# EAGLE design 05_ServoStage_v1 (EAGLE 9.6.2)

## Sheet 1 of 2
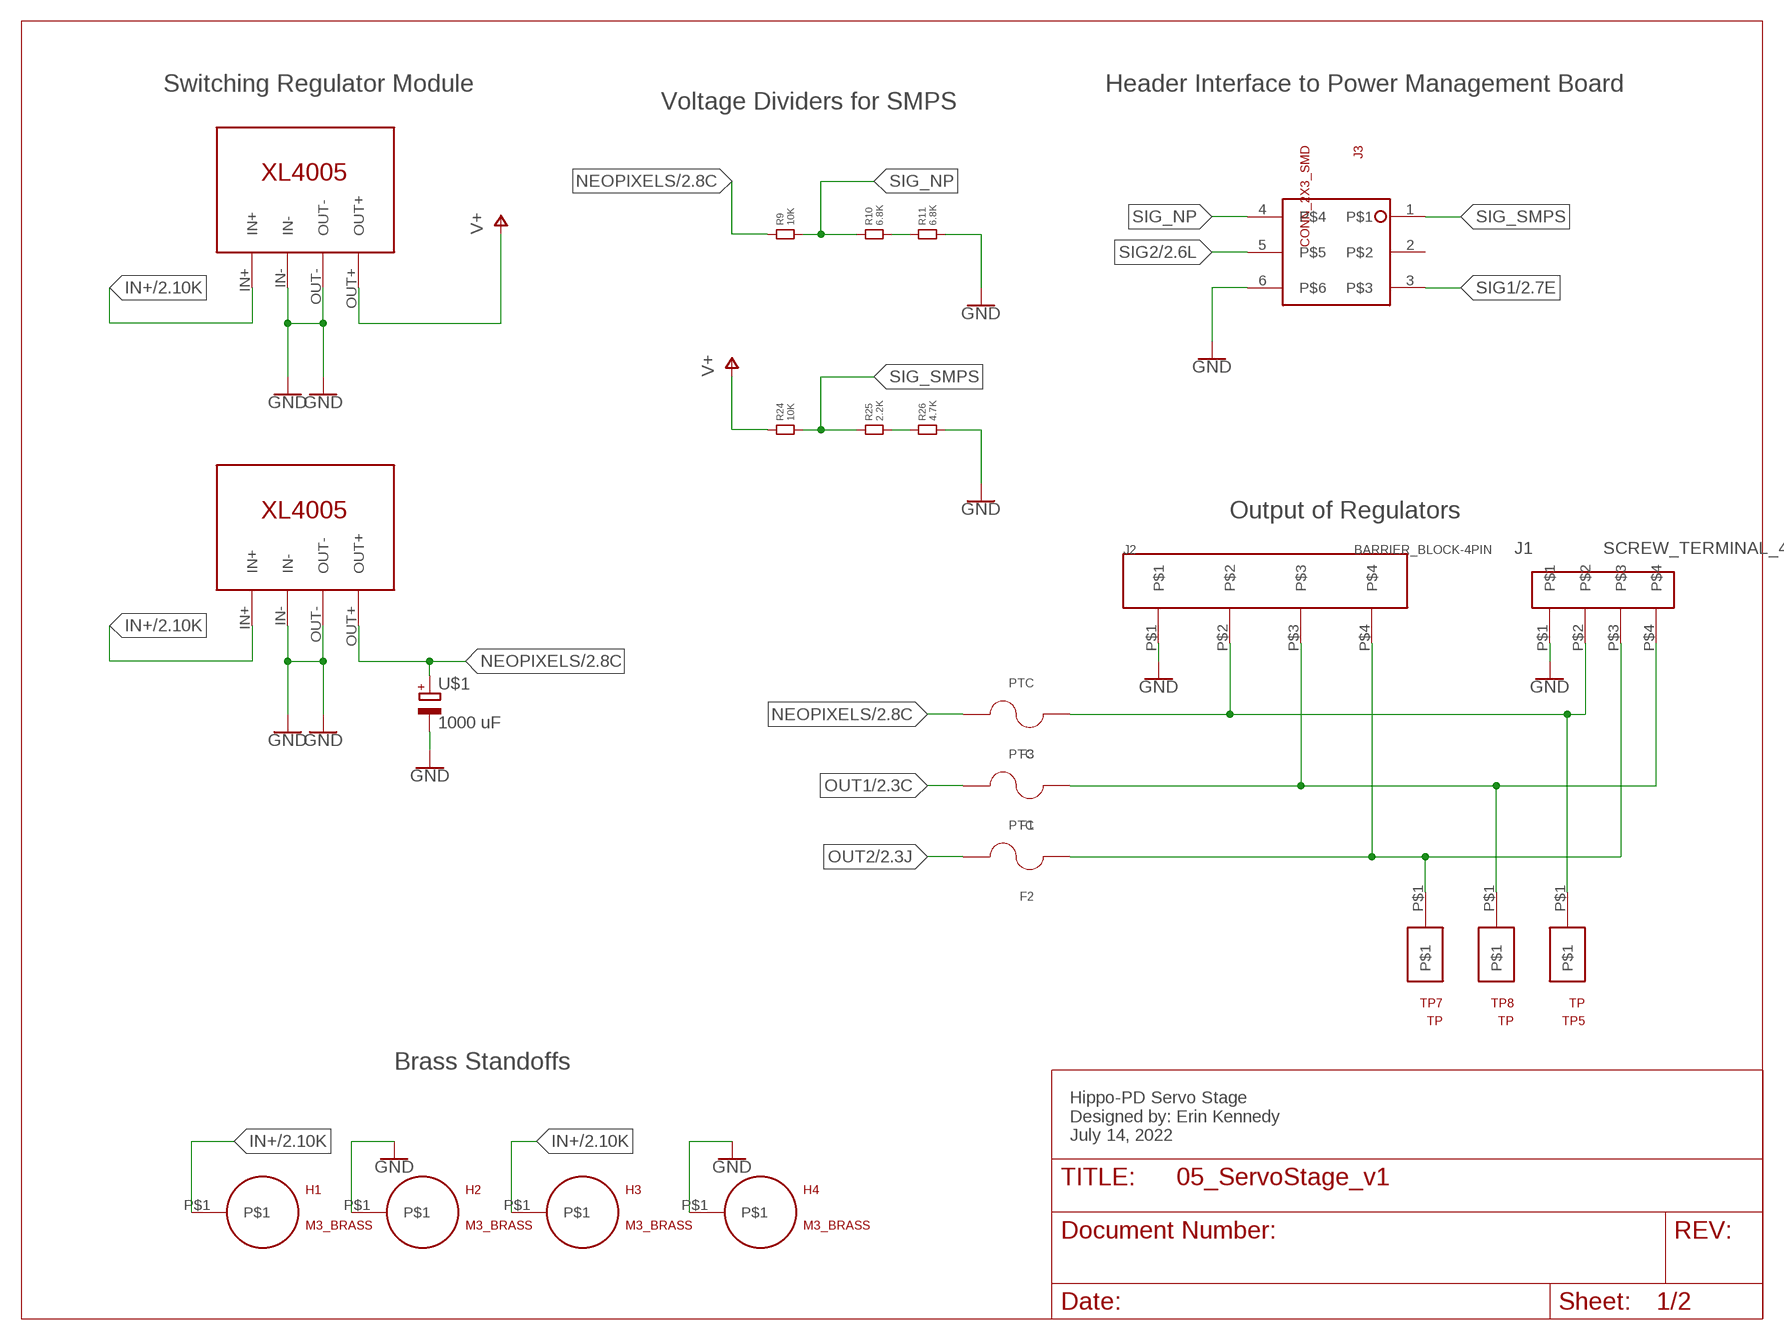
[diagram p0: schematic, sheet 1]

### Parts
F1  PTC  [PTC]
F2  PTC  [PTC]
F3  PTC  [PTC]
H1  M3_BRASS  [M3_BRASS]
H2  M3_BRASS  [M3_BRASS]
H3  M3_BRASS  [M3_BRASS]
H4  M3_BRASS  [M3_BRASS]
J1  SCREW_TERMINAL_4  [SCREW_TERM_4]
J2  BARRIER_BLOCK-4PIN  [BARRIERBLOCK-4PIN]
J3  CONN_2X3_SMD  [2X3_SMD_CONNECTOR]
R9  10K  RESISTOR.1206  [1206]
R10  6.8K  RESISTOR.1206  [1206]
R11  6.8K  RESISTOR.1206  [1206]
R24  10K  RESISTOR.1206  [1206]
R25  2.2K  RESISTOR.1206  [1206]
R26  4.7K  RESISTOR.1206  [1206]
TP5  TP  [TP]
TP7  TP  [TP]
TP8  TP  [TP]
U1  XL4005-DEV  [XL4005-DEV]
U2  XL4005-DEV  [XL4005-DEV]
U$1  1000 uF  ELECTROLYTIC_CAP  [ELECTROLYTIC_CAP]

### Nets
GND: H2.P$1 H4.P$1 J1.P$1 J2.P$1 J3.6 R11.2 R26.2 U1.IN- U1.OUT- U2.IN- U2.OUT- U$1.- ; also sheet 2
IN+: H1.P$1 H3.P$1 U1.IN+ U2.IN+ ; also sheet 2
N$2: F3.1 J1.P$2 J2.P$2 TP5.P$1
N$9: R25.2 R26.1
N$17: F1.1 J1.P$4 J2.P$3 TP8.P$1
N$18: F2.1 J1.P$3 J2.P$4 TP7.P$1
N$23: R10.2 R11.1
NEOPIXELS: F3.2 R9.1 U2.OUT+ U$1.+ ; also sheet 2
OUT1: F1.2 ; also sheet 2
OUT2: F2.2 ; also sheet 2
SIG1: J3.3 ; also sheet 2
SIG2: J3.5 ; also sheet 2
SIG_NP: J3.4 R9.2 R10.1
SIG_SMPS: J3.1 R24.2 R25.1
V+: R24.1 U1.OUT+ ; also sheet 2
Unconnected: J3.2

### Notes on the sheet
- Switching Regulator Module | Header Interface to Power Management Board
- Voltage Dividers for SMPS
- Output of Regulators
- Brass Standoffs
- Hippo-PD Servo Stage
  Designed by: Erin Kennedy
  July 14, 2022

## Sheet 2 of 2
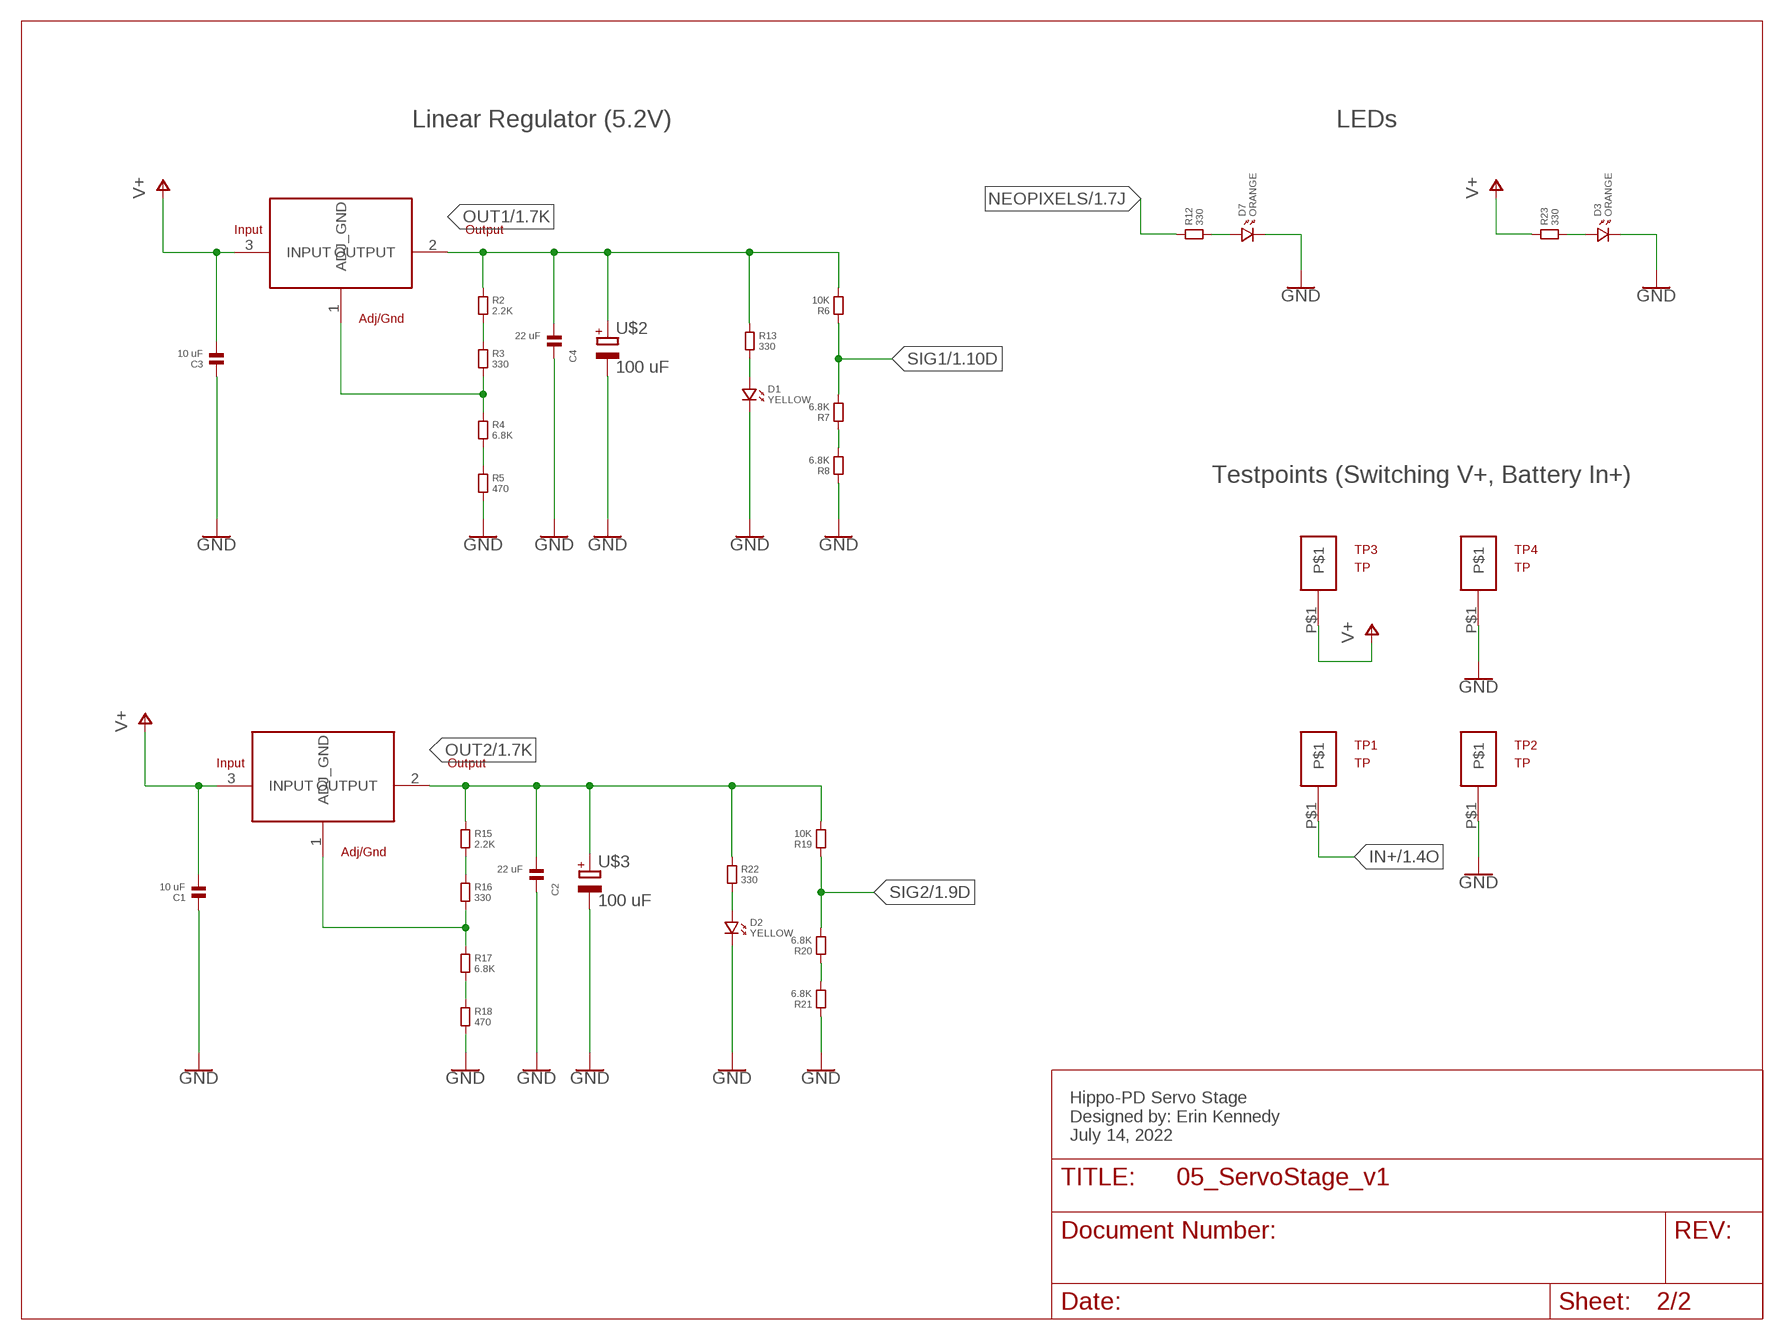
[diagram p1: schematic, sheet 2]

### Parts
C1  10 uF  CAPACITOR.1206  [1206]
C2  22 uF  CAPACITOR.1206  [1206]
C3  10 uF  CAPACITOR.1206  [1206]
C4  22 uF  CAPACITOR.1206  [1206]
D1  YELLOW  LED.1206  [1206.LED]
D2  YELLOW  LED.1206  [1206.LED]
D3  ORANGE  LED.1206  [1206.LED]
D7  ORANGE  LED.1206  [1206.LED]
R1  AZ1084C  [AZ1084C]
R2  2.2K  RESISTOR.1206  [1206]
R3  330  RESISTOR.1206  [1206]
R4  6.8K  RESISTOR.1206  [1206]
R5  470  RESISTOR.1206  [1206]
R6  10K  RESISTOR.1206  [1206]
R7  6.8K  RESISTOR.1206  [1206]
R8  6.8K  RESISTOR.1206  [1206]
R12  330  RESISTOR.1206  [1206]
R13  330  RESISTOR.1206  [1206]
R14  AZ1084C  [AZ1084C]
R15  2.2K  RESISTOR.1206  [1206]
R16  330  RESISTOR.1206  [1206]
R17  6.8K  RESISTOR.1206  [1206]
R18  470  RESISTOR.1206  [1206]
R19  10K  RESISTOR.1206  [1206]
R20  6.8K  RESISTOR.1206  [1206]
R21  6.8K  RESISTOR.1206  [1206]
R22  330  RESISTOR.1206  [1206]
R23  330  RESISTOR.1206  [1206]
TP1  TP  [TP]
TP2  TP  [TP]
TP3  TP  [TP]
TP4  TP  [TP]
U$2  100 uF  ELECTROLYTIC_CAP  [ELECTROLYTIC_CAP]
U$3  100 uF  ELECTROLYTIC_CAP  [ELECTROLYTIC_CAP]

### Nets
GND: C1.1 C2.1 C3.1 C4.1 D1.P$2 D2.P$2 D3.P$2 D7.P$2 R5.2 R8.1 R18.2 R21.1 TP2.P$1 TP4.P$1 U$2.- U$3.- ; also sheet 1
IN+: TP1.P$1 ; also sheet 1
N$1: D7.P$1 R12.2
N$3: D1.P$1 R13.2
N$4: R2.2 R3.1
N$5: R1.1(ADJ_GND) R3.2 R4.1
N$6: R4.2 R5.1
N$7: D3.P$1 R23.2
N$8: R7.1 R8.2
N$10: D2.P$1 R22.2
N$11: R15.2 R16.1
N$12: R14.1(ADJ_GND) R16.2 R17.1
N$13: R17.2 R18.1
N$14: R20.1 R21.2
NEOPIXELS: R12.1 ; also sheet 1
OUT1: C4.2 R1.2(OUTPUT) R2.1 R6.2 R13.1 U$2.+ ; also sheet 1
OUT2: C2.2 R14.2(OUTPUT) R15.1 R19.2 R22.1 U$3.+ ; also sheet 1
SIG1: R6.1 R7.2 ; also sheet 1
SIG2: R19.1 R20.2 ; also sheet 1
V+: C1.2 C3.2 R1.3(INPUT) R14.3(INPUT) R23.1 TP3.P$1 ; also sheet 1

### Notes on the sheet
- Linear Regulator (5.2V) | LEDs
- Testpoints (Switching V+, Battery In+)
- Hippo-PD Servo Stage
  Designed by: Erin Kennedy
  July 14, 2022

## Library data of the parts
C1-C4 = standardparts:CAPACITOR
D1-D3 D7 = standardparts:LED
F1-F3 = Hippo-PS:PTC: PTC Resettable Fuse 0.75A(hold) 1.5A(trip) 60VDC 40A 1.5W 0.3s 0.18Ohm SMD Solder Pad 7.98 X 5.44 X 1.15mm T/R Check availability <https://pricing.snapeda.com/parts/0ZCF0075AF2C/Bel%20Fuse/view-part?ref=eda>; AVAILABILITY: In Stock; DESCRIPTION: 2920 SMT PPTC | 0.75 Ih | 603V; MF: Bel Fuse; MP: 0ZCF0075AF2C; PACKAGE: 2920 Bel Fuse; PRICE: None; PURCHASE-URL: https://pricing.snapeda.com/search/part/0ZCF0075AF2C/?ref=eda
H1-H4 = Hippo-PS:M3_BRASS
J1 = EK's Parts:SCREW_TERMINAL_4
J2 = Hippo-PS:BARRIER_BLOCK-4PIN: Barrier block connector Digikey #ED2946-ND
J3 = Hippo-PS:CONN_2X3_SMD
R1 R14 = Hippo-PS:AZ1084C
R2-R13 R15-R26 = standardparts:RESISTOR
TP1-TP5 TP7 TP8 = Hippo-PS:TP
U1 U2 = Hippo-PS:XL4005-DEV
U$1-U$3 = Hippo-PS:ELECTROLYTIC_CAP: Check availability <https://pricing.snapeda.com/parts/865080545012/Wurth%20Electronics/view-part?ref=eda>; AVAILABILITY: In Stock; DESCRIPTION: 100 µF 35 V Aluminum Electrolytic Capacitors Radial, Can - SMD - 2000 Hrs @ 105°C; MF: Wurth Electronics; MP: 865080545012; PACKAGE: Radial Würth Elektronik; PRICE: None; PURCHASE-URL: https://pricing.snapeda.com/search/part/865080545012/?ref=eda

## Board
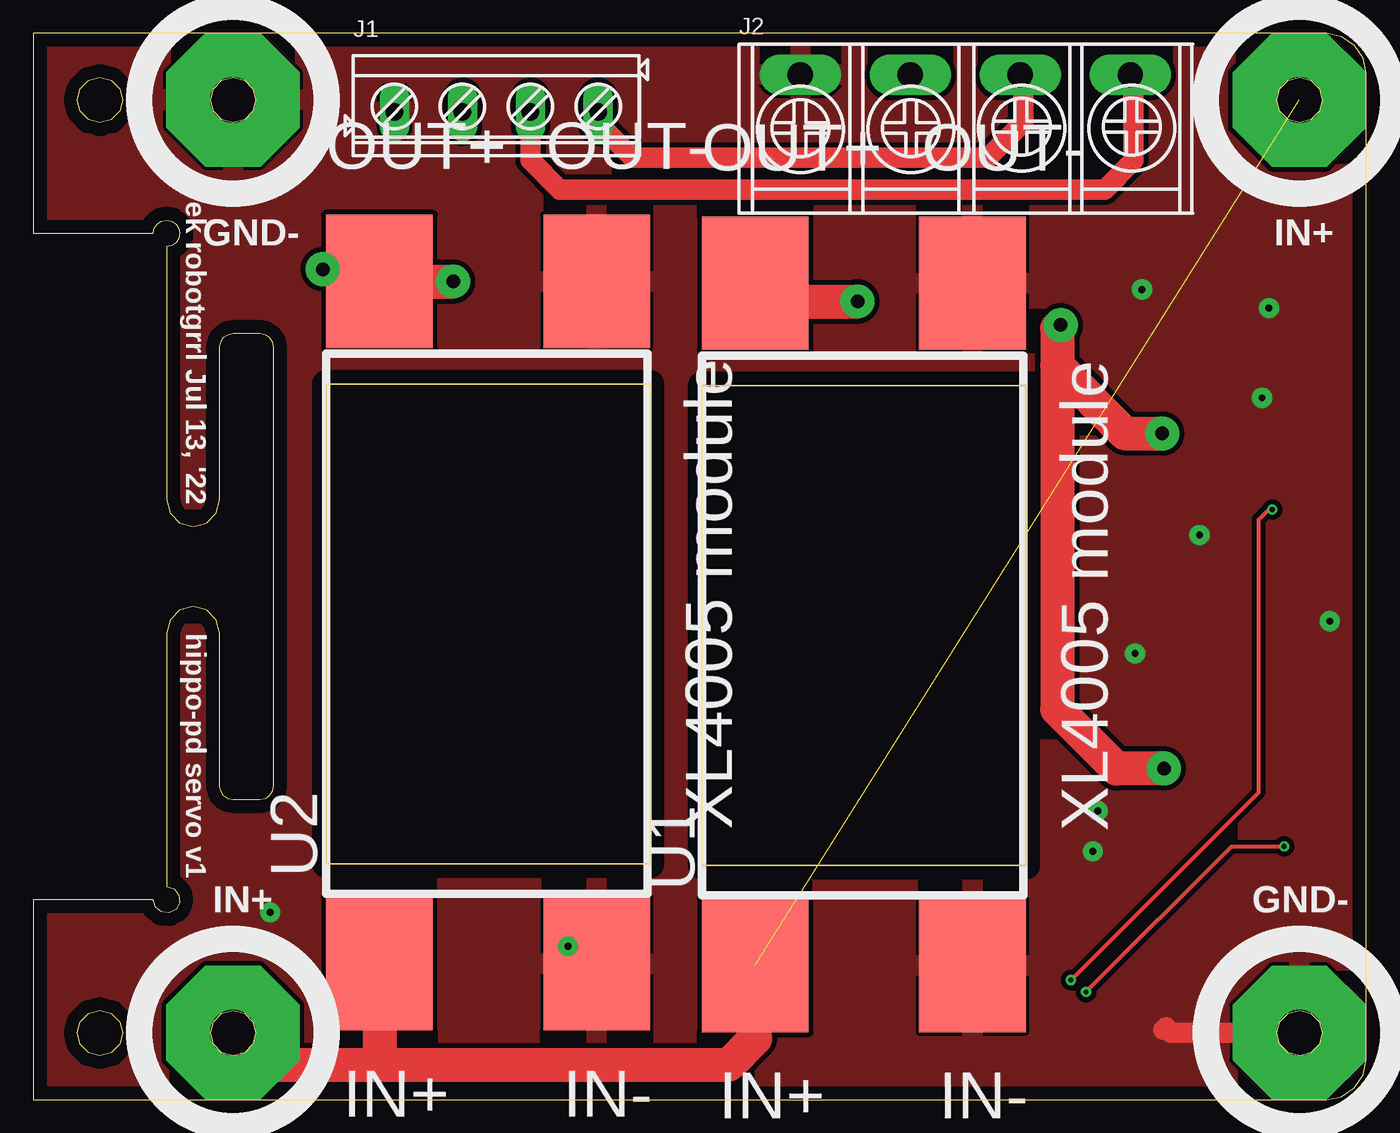
[diagram p2: board, top side]
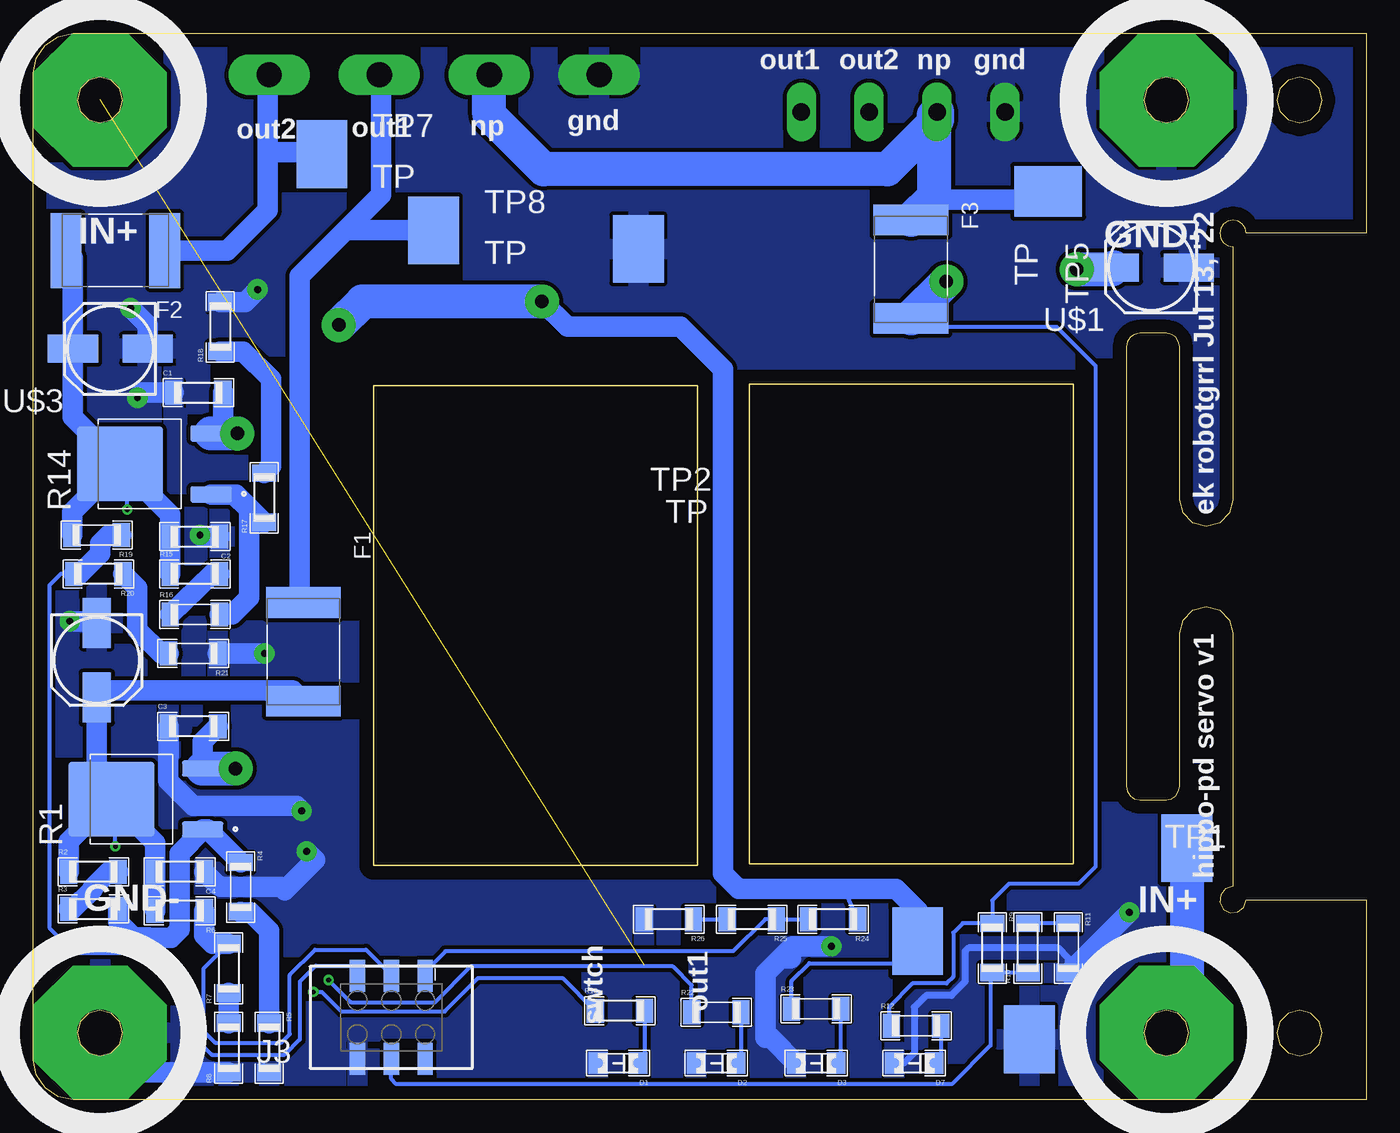
[diagram p3: board, bottom side, seen from below]

Size 100 x 80 mm. Coordinates in mm from the lower left corner, seen from the top.
Outline: 100,77 99.77,78.15 99.12,79.12 98.15,79.77 97,80 0,80 0,65 9,65 9.08,65.39 9.29,65.71 9.61,65.92 10,66 10.39,65.92 10.71,65.71 10.92,65.39 11,65 10.92,64.61 10.71,64.29 10.39,64.08 10,64 10,45 10.27,44 11,43.27 12,43 13,43.27 13.73,44 14,45 14,56.5 14.08,56.89 14.29,57.21 14.61,57.42 15,57.5 17,57.5 17.39,57.42 17.71,57.21 17.92,56.89 18,56.5 18,23.5 17.92,23.11 17.71,22.79 17.39,22.58 17,22.5 15,22.5 14.61,22.58 14.29,22.79 14.08,23.11 14,23.5 14,35 13.73,36 13,36.73 12,37 11,36.73 10.27,36 10,35 10,16 10.56,15.83 10.92,15.38 10.98,14.8 10.71,14.29 10.2,14.02 9.62,14.08 9.17,14.44 9,15 0,15 0,0 97,0 98.15,0.23 99.12,0.88 99.77,1.85 100,3 100,77
Outline: 6.7,75 6.47,74.15 5.85,73.53 5,73.3 4.15,73.53 3.53,74.15 3.3,75 3.53,75.85 4.15,76.47 5,76.7 5.85,76.47 6.47,75.85 6.7,75
Outline: 96.7,75 96.47,74.15 95.85,73.53 95,73.3 94.15,73.53 93.53,74.15 93.3,75 93.53,75.85 94.15,76.47 95,76.7 95.85,76.47 96.47,75.85 96.7,75
Outline: 96.7,5 96.47,4.15 95.85,3.53 95,3.3 94.15,3.53 93.53,4.15 93.3,5 93.53,5.85 94.15,6.47 95,6.7 95.85,6.47 96.47,5.85 96.7,5
Outline: 16.7,75 16.47,74.15 15.85,73.53 15,73.3 14.15,73.53 13.53,74.15 13.3,75 13.53,75.85 14.15,76.47 15,76.7 15.85,76.47 16.47,75.85 16.7,75
Outline: 16.7,5 16.47,4.15 15.85,3.53 15,3.3 14.15,3.53 13.53,4.15 13.3,5 13.53,5.85 14.15,6.47 15,6.7 15.85,6.47 16.47,5.85 16.7,5
Outline: 6.7,5 6.47,4.15 5.85,3.53 5,3.3 4.15,3.53 3.53,4.15 3.3,5 3.53,5.85 4.15,6.47 5,6.7 5.85,6.47 6.47,5.85 6.7,5
Copper layers (1*16): Top 0.035mm / dielectric 1.5mm / Bottom 0.035mm
Design rules "default *": minimum track width 8mil, minimum drill 0.35mm, track to track 10mil, track to pad 10mil, pad to pad 10mil, via to via 10mil, smd to smd 10mil, copper to edge 40mil, drill to drill 10mil, minimum pad ring 10mil, minimum via ring 8mil, stop-mask expansion 4mil, vias tented up to drill 0mil, thermal gap 10mil

### Footprints (pad centres in the part's own frame; a part is rotated, then mirrored left to right if it is on the bottom)
1206 = smd 1.3 x 1.8: 1 -1.85,0; 2 1.85,0
1206.LED = smd 1.4 x 1.6: P$1 -1.5,0; P$2 1.5,0
PTC = smd 2.3 x 5.6: 1 -3.7,0; 2 3.7,0
M3_BRASS = drill 3.4 pad 10 octagon: P$1 0,0
SCREW_TERM_4 = drill 1.3 pad 2.2 long: P$1 3.1,3.3; P$2 8.2,3.3; P$3 13.3,3.3; P$4 18.38,3.3
BARRIERBLOCK-4PIN = drill 1.905 pad 3.048 long: P$1 4.6,10.4; P$2 12.85,10.4; P$3 21.1,10.4; P$4 29.355,10.4
2X3_SMD_CONNECTOR = smd 1.147 x 2.408: 1 -2.54,-3.104; 2 -2.54,3.104; 3 0,-3.104; 4 0,3.104; 5 2.54,-3.104; 6 2.54,3.104
AZ1084C = smd 1.204 x 3.098: 1 -2.286,-4.26; 3 2.286,-4.26 | smd 5.63 x 6.448: 2 0,2.59
TP = smd 3.81 x 5.08: P$1 0,0
XL4005-DEV = smd 8 x 10: IN+ 4,-5; IN- 20.3,-5; OUT+ 4,46.2; OUT- 20.3,46.2
ELECTROLYTIC_CAP = smd 3.754 x 2.108: + 2.8,0; - -2.8,0

### Placement (x,y rotation side)
C1  87.62,53.04 0 bottom
C2  87.88,42.24 180 bottom
C3  88,28.02 0 bottom
C4  89.02,17.1 180 bottom
D1  56.13,2.75 180 bottom
D2  48.76,2.75 180 bottom
D3  41.27,2.75 180 bottom
D7  33.9,2.75 180 bottom
F1  79.75,33.61 270 bottom
F2  93.85,63.71 180 bottom
F3  34.16,62.31 270 bottom
H1  14.98,5.03 0 top
H2  94.99,5.03 0 top
H3  94.99,75.01 0 top
H4  14.98,75.01 0 top
J1  24,70.82 0 top
J2  52.95,66.5 0 top
J3  73.14,6.18 180 bottom
R1  91.56,22.56 90 bottom
R2  95.5,17.1 0 bottom
R3  95.5,14.3 0 bottom
R4  84.45,15.95 270 bottom
R5  82.29,3.89 270 bottom
R6  89.02,14.18 180 bottom
R7  85.34,9.86 90 bottom
R8  85.34,3.89 90 bottom
R9  28.06,11.38 270 bottom
R10  25.39,11.38 90 bottom
R11  22.34,11.38 270 bottom
R12  33.77,5.54 0 bottom
R13  56,6.68 0 bottom
R14  90.92,47.7 90 bottom
R15  87.88,39.45 0 bottom
R16  87.88,36.4 0 bottom
R17  82.67,45.16 90 bottom
R18  85.97,57.99 90 bottom
R19  95.24,42.37 180 bottom
R20  95.12,39.45 180 bottom
R21  88,33.48 180 bottom
R22  48.76,6.56 0 bottom
R23  41.27,6.81 0 bottom
R24  40,13.54 180 bottom
R25  46.09,13.54 180 bottom
R26  52.32,13.54 180 bottom
TP1  13.45,18.88 0 bottom
TP2  54.6,63.83 0 bottom
TP3  33.65,11.89 0 bottom
TP4  25.27,4.52 180 bottom
TP5  23.87,68.15 270 bottom
TP7  78.35,70.95 0 bottom
TP8  69.97,65.23 0 bottom
U1  50.16,15.07 0 top
U2  21.96,15.19 0 top
U$1  16.12,62.44 180 bottom
U$2  95.24,32.97 270 bottom
U$3  94.23,56.34 180 bottom

### Tracks (layer width: path | path; a pad name or v marks a point on that pad's centre or on a via)
GND  (via drill 0.51 pad 1.52)
  Top 1.524: H2.P$1 85.34,5.03 84.96,5.41 84.76,5.22 | U2.IN- 41.44,10.19 v40.12,11.51 40.38,11.51
  Bottom 0.508: R11.2 22.34,10.62 23.11,11.38 29.84,11.38 30.09,11.13 30.09,8.84 31.11,7.83 33.01,7.83 33.9,6.94 33.9,3.51 34.66,2.75 D7.P$2
  Bottom 1.524: H2.P$1 92,2.04 R8.1 | C3.1 89.85,25.79 89.86,25.78 89.86,23.91 88.01,22.05 80.26,22.05 v79.88,21.67 | C4.1 86.16,16.09 86.1,16.09 85.96,15.95 81.4,15.95 81.15,15.7 78.86,17.99 v79.49,18.62 | D3.P$2 44.67,4.65 45.08,4.65 45.08,9.48 44.59,9.96 43.93,10.62 | 43.17,10.62 43.93,10.62 | 43.93,10.62 43.04,11.51 v40.12,11.51 | R11.2 22.29,9.53 v17.77,14.05 | U$2.- 95.36,35.89 v97.27,35.89 | R21.1 v82.67,33.48 | C2.1 87.37,42.24 v87.5,42.37 | C1.1 91.81,53.04 v92.19,52.66 | U$3.- 91.43,58.11 v92.7,59.39 | R18.2 84.12,59.84 v83.18,60.79
  pour Bottom (isolate 0.305): -4.58,85.93 -4.58,-5.51 107.18,-5.51 107.18,85.93
  pour Top (isolate 0.381): -4.58,87.84 -4.58,-5.51 107.18,-5.51 107.18,87.84
IN+  (1 unrouted)
  Top 2.54: H1.P$1 17.39,2.62 25.77,2.62 | 25.77,2.62 52.19,2.62 54.16,4.59 U1.IN+ | U2.IN+ 25.96,2.95 26.04,2.88 25.77,2.62
  Bottom 2.54: TP1.P$1 13.45,6.56 H1.P$1
N$1
  Bottom 0.305: D7.P$1 31.92,3.22 R12.2
N$2
  Bottom 1.524: 32.45,67.72 32.25,67.52 24.5,67.52 TP5.P$1
  Bottom 2.54: F3.1 32.45,67.72 32.45,73.86 J1.P$2 32.2,73.54 35.93,69.8 61.71,69.8 65.8,73.89 J2.P$2
N$3
  Bottom 0.305: R13.2 54.15,3.22 D1.P$1
N$4
  Bottom 1.524: R2.2 94.35,17.1 95.55,15.9 95.55,15.78 97.03,14.3 R3.1
N$5
  Bottom 1.524: R4.1 86.92,20.27 87.24,20.27 | 87.24,20.27 R1.1 | R3.2 93.65,13.34 92.47,12.17 91.33,12.17 91.3,12.14 89.65,12.14 89.02,12.78 89.02,18.49 87.24,20.27
N$6
  Bottom 1.524: R4.2 84.39,14.05 83.69,14.05 82.29,12.65 R5.1
N$7
  Bottom 0.305: D3.P$1 39.42,3.1 R23.2
N$8
  Bottom 1.524: R7.1 R8.2
N$9
  Bottom 0.305: R26.1 R25.2 47.77,13.54
N$10
  Bottom 0.305: R22.2 46.91,3.1 D2.P$1
N$11
  Bottom 1.524: R15.2 86.59,39.45 R16.1
N$12
  Bottom 1.524: R16.2 85.08,36.4 83.81,37.67 83.81,44.28 84.96,45.42 R14.1 84.77,45.42 R17.1
N$13
  Bottom 1.524: R17.2 82.16,47.52 82.16,54.05 84.25,56.14 R18.1
N$14
  Bottom 1.524: R20.1 92.19,38.38 92.19,35.26 90.42,33.48 R21.2
N$17
  Top 1.524: J1.P$4 42.38,73.27 44.95,70.69 71.62,70.69 74.29,73.36 74.29,76.66 J2.P$3
  Bottom 1.524: F1.1 80,37.56 80,61.8 76.57,65.23 | 76.57,65.23 73.91,67.9 73.91,76.76 J2.P$3 | TP8.P$1 76.57,65.23
N$18
  Top 1.524: J1.P$3 37.3,70.47 39.49,68.28 80.38,68.28 82.54,70.44 82.54,76.66 J2.P$4
  Bottom 1.524: F2.1 85.46,63.71 82.42,66.75 82.42,71.07 | J2.P$4 82.42,76.79 82.42,71.07 | TP7.P$1 78.48,71.07 82.42,71.07
N$23
  Bottom 0.305: R11.1 R10.2
NEOPIXELS  (via drill 1.02 pad 2.54)
  Top 2.54: v21.71,62.31 25.05,62.31 U2.OUT+ v31.5,61.39
  Bottom 0.305: F3.2 33.54,57.99 23.23,57.99 20.31,55.07 20.31,17.48 21.58,16.21 26.79,16.21 28.06,14.94 R9.1 30.27,13.23 30.98,12.53 30.98,9.22 31.49,8.72 34.03,8.72 35.81,6.94 35.81,5.72 R12.1
  Bottom 2.54: v21.71,62.31 19.05,62.31 U$1.+ | v31.5,61.39 34.16,58.74 F3.2
OUT1  (via drill 0.35)
  Top 0.305: v78.99,8.08 89.91,19 v93.85,19
  Bottom 0.305: R13.1 60.26,9.1 66.67,9.1 69.14,6.62 76.89,6.62 78.35,8.08 v78.99,8.08 | v93.85,19 93.85,22.25 R1.2
  Bottom 1.524: R1.2 94.78,21.92 | R1.2 94.35,22.76 | F1.2 80.53,30.69 95.24,30.69 U$2.+ 95.24,23.65 R1.2 | R1.2 90.87,19.28 C4.2 R6.2 | R2.1 97.35,19.36 R1.2
OUT2  (via drill 0.35)
  Top 0.305: v77.84,8.97 91.94,23.07 91.94,43.51 92.7,44.28 v92.96,44.28
  Bottom 0.305: R22.1 50.61,8.59 52.01,9.99 67.18,9.99 69.84,7.32 76.19,7.32 v77.84,8.97 | v92.96,44.28 92.96,47.15 R14.2
  Bottom 1.524: R14.2 97.03,51.22 U$3.+ 97.03,63.19 F2.2 | R14.2 89.73,43.92 C2.2 R15.1 | R19.2 97.09,44.08 93.51,47.65 R14.2
SIG1
  Bottom 0.305: R7.2 87.24,9.8 87.24,5.16 86.35,4.27 81.4,4.27 80.76,4.91 80.76,9.35 78.86,11.26 75.05,11.26 73.14,9.35 J3.3
  Bottom 1.524: R6.1 87.17,12.33 86.55,11.71 R7.2
SIG2
  Bottom 0.305: R20.2 97.94,39.45 98.8,38.59 98.8,12.91 96.89,11 91.81,11 88,7.19 88,4.78 86.61,3.38 81.15,3.38 80,4.52 80,8.84 78.8,10.04 75.94,10.04 75.68,9.79 J3.5
  Bottom 1.524: R19.1 94.35,42.37 94.99,41.74 94.99,40.97 96.51,39.45 R20.2
SIG_NP
  Bottom 0.305: R10.1 27.81,9.53 R9.2 | R9.2 28.19,9.53 28.19,4.08 31.09,1.17 72.76,1.17 73.14,1.55 J3.4 | R9.2 28.19,9.41
SIG_SMPS
  Bottom 0.305: J3.1 70.6,9.6 69.08,11.13 47.49,11.13 45.08,13.54 R25.1 R24.2
V+  (via drill 1.02 pad 2.54)
  Top 2.54: U1.OUT+ 55.53,59.9 v61.84,59.9 | v77.08,58.12 76.83,57.86 76.83,55.07 | 76.83,55.07 81.91,49.99 v84.7,49.99 | 76.83,55.07 76.83,29.29 81.27,24.84 v84.83,24.84
  Bottom 0.305: R24.1 39.19,15.83 | R23.1 43.12,8.9 41.78,10.24 34.66,10.24 33.65,11.26 TP3.P$1
  Bottom 1.524: v61.84,59.9 59.94,57.99 51.43,57.99 48.25,54.82 48.25,16.97 47.11,15.83 39.19,15.83 35.3,15.83 33.65,14.18 TP3.P$1 | C3.2 87.3,26.87 R1.3 | R14.3 85.77,50.88 C1.2
  Bottom 2.54: v61.84,59.9 75.3,59.9 v77.08,58.12 | v84.7,49.99 R14.3 | R1.3 v84.83,24.84

### Text on the board
tPlace: ek robotgrrl Jul 13, '22 | GND- | IN+ | hippo-pd servo v1 | IN+ | GND-
bPlace: gnd | np | out2 | out1 | gnd | np | out1 | out2 | GND- | IN+ | ek robotgrrl Jul 13, '22 | + | hippo-pd servo v1 | IN+ | GND- | swtch | out1
tNames: word